# Altium schematic sheet Condor2_80_Pin_REV_C.SchDoc
size A4; DrawnBy: Philip Rowse
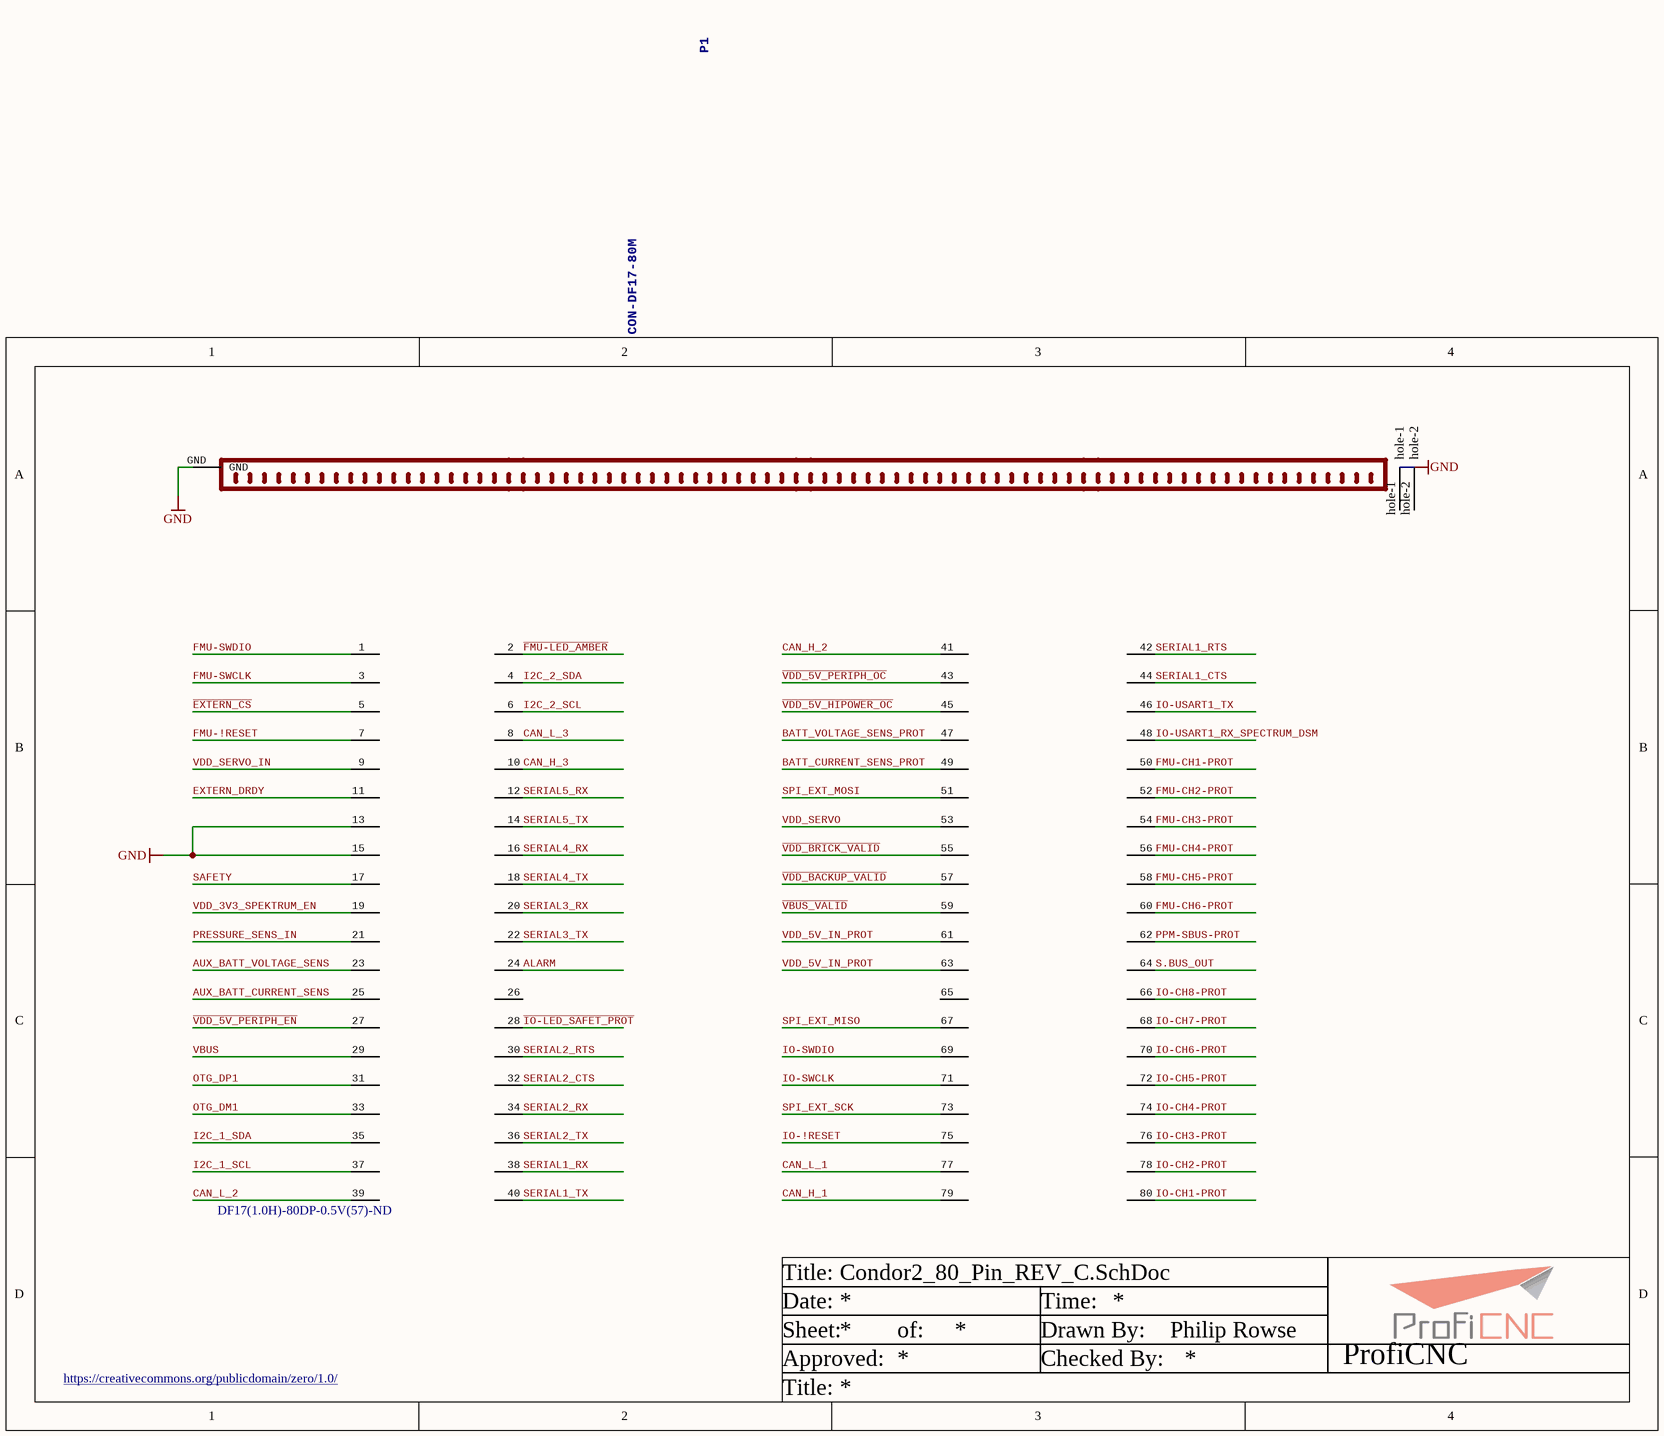
[diagram p0: Condor2_80_Pin_REV_C.SchDoc]

## Parts
P1  CON-DF17-80M  Supplier Part Number 1: DF17(1.0H)-80DP-0.5V(57)-ND  [CON-DF17-80M]

## Nets
GND: P1.13 P1.15 P1.GND
ALARM: P1.24
AUX_BATT_CURRENT_SENS: P1.25
AUX_BATT_VOLTAGE_SENS: P1.23
BATT_CURRENT_SENS_PROT: P1.49
BATT_VOLTAGE_SENS_PROT: P1.47
CAN_H_1: P1.79
CAN_H_2: P1.41
CAN_H_3: P1.10
CAN_L_1: P1.77
CAN_L_2: P1.39
CAN_L_3: P1.8
~{EXTERN_CS}: P1.5
EXTERN_DRDY: P1.11
~{FMU-LED_AMBER}: P1.2
FMU-!RESET: P1.7
FMU-CH1-PROT: P1.50
FMU-CH2-PROT: P1.52
FMU-CH3-PROT: P1.54
FMU-CH4-PROT: P1.56
FMU-CH5-PROT: P1.58
FMU-CH6-PROT: P1.60
FMU-SWCLK: P1.3
FMU-SWDIO: P1.1
I2C_1_SCL: P1.37
I2C_1_SDA: P1.35
I2C_2_SCL: P1.6
I2C_2_SDA: P1.4
~{IO-LED_SAFET_PROT}: P1.28
IO-!RESET: P1.75
IO-CH1-PROT: P1.80
IO-CH2-PROT: P1.78
IO-CH3-PROT: P1.76
IO-CH4-PROT: P1.74
IO-CH5-PROT: P1.72
IO-CH6-PROT: P1.70
IO-CH7-PROT: P1.68
IO-CH8-PROT: P1.66
IO-SWCLK: P1.71
IO-SWDIO: P1.69
IO-USART1_RX_SPECTRUM_DSM: P1.48
IO-USART1_TX: P1.46
OTG_DM1: P1.33
OTG_DP1: P1.31
PPM-SBUS-PROT: P1.62
PRESSURE_SENS_IN: P1.21
S.BUS_OUT: P1.64
SAFETY: P1.17
SERIAL1_CTS: P1.44
SERIAL1_RTS: P1.42
SERIAL1_RX: P1.38
SERIAL1_TX: P1.40
SERIAL2_CTS: P1.32
SERIAL2_RTS: P1.30
SERIAL2_RX: P1.34
SERIAL2_TX: P1.36
SERIAL3_RX: P1.20
SERIAL3_TX: P1.22
SERIAL4_RX: P1.16
SERIAL4_TX: P1.18
SERIAL5_RX: P1.12
SERIAL5_TX: P1.14
SPI_EXT_MISO: P1.67
SPI_EXT_MOSI: P1.51
SPI_EXT_SCK: P1.73
~{VBUS_VALID}: P1.59
~{VDD_5V_HIPOWER_OC}: P1.45
~{VDD_5V_PERIPH_EN}: P1.27
~{VDD_5V_PERIPH_OC}: P1.43
~{VDD_BACKUP_VALID}: P1.57
~{VDD_BRICK_VALID}: P1.55
VBUS: P1.29
VDD_3V3_SPEKTRUM_EN: P1.19
VDD_5V_IN_PROT: P1.61 P1.63
VDD_SERVO: P1.53
VDD_SERVO_IN: P1.9

Not connected (* = marked no-connect by the designer): P1 26 65 hole-1 hole-2

## Notes on the sheet
- Title:
- Date:
- Time:
- https://creativecommons.org/publicdomain/zero/1.0/
- Sheet:
- Approved:
- of:
- Drawn By:
- Checked By:
- ProfiCNC

## Library data of the parts
P1 = CON-DF17-80M: Connector, Header, 80Pos, .5MM, DUAL, SMD, Au; Supplier 1: Digi-Key